# EAGLE design 8CH-Level-Shifter (EAGLE 9.6.2)
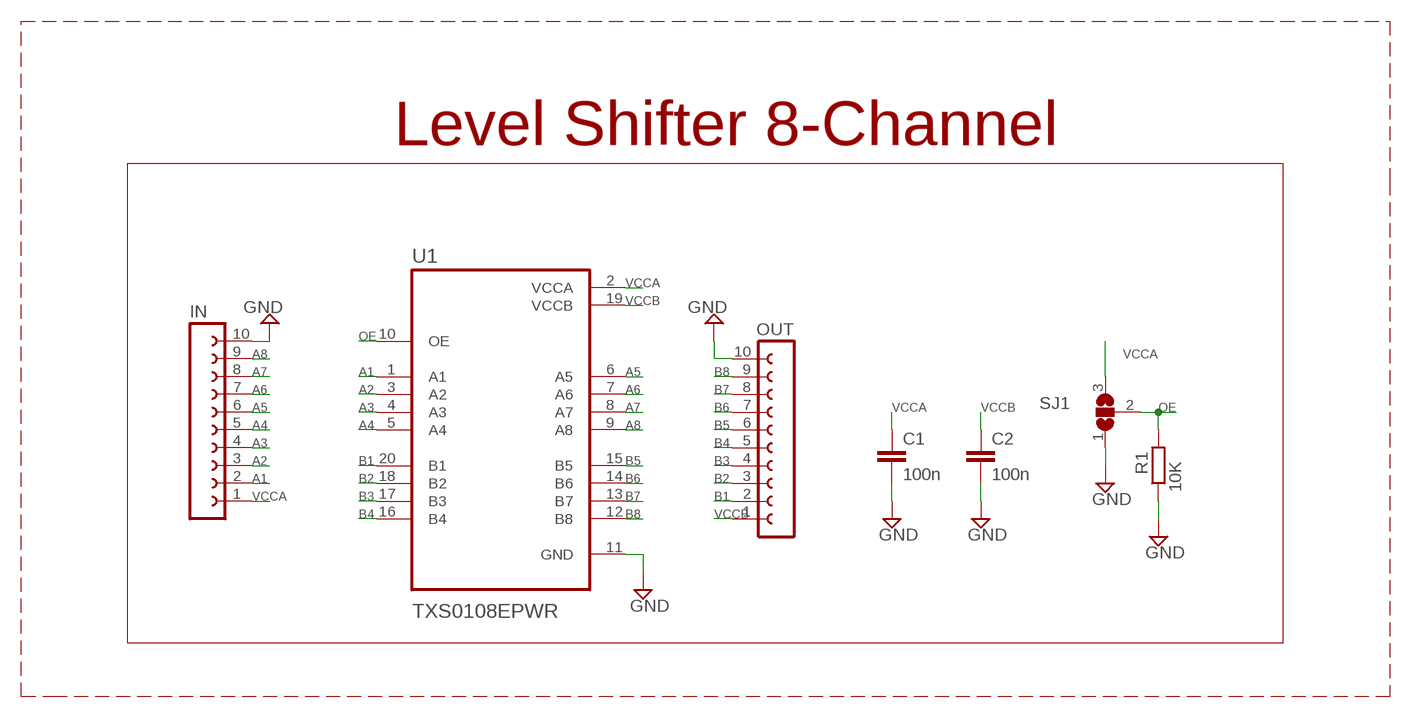
[diagram p0: schematic, sheet 1]

## Parts
C1  100n  C-EUC0805  [C0805]
C2  100n  C-EUC0805  [C0805]
IN  CON-LSTA_FE10-1  [CON-LSTA_FE10]
OUT  CON-LSTA_FE10-1  [CON-LSTA_FE10]
R1  10K  R-EU_R0805  [R0805]
SJ1  SJ2W  [SJ_2]
U1  TXS0108EPWR  [SOP65P640X120-20N]

## Nets
A1: IN.2 U1.1(A1)
A2: IN.3 U1.3(A2)
A3: IN.4 U1.4(A3)
A4: IN.5 U1.5(A4)
A5: IN.6 U1.6(A5)
A6: IN.7 U1.7(A6)
A7: IN.8 U1.8(A7)
A8: IN.9 U1.9(A8)
B1: OUT.2 U1.20(B1)
B2: OUT.3 U1.18(B2)
B3: OUT.4 U1.17(B3)
B4: OUT.5 U1.16(B4)
B5: OUT.6 U1.15(B5)
B6: OUT.7 U1.14(B6)
B7: OUT.8 U1.13(B7)
B8: OUT.9 U1.12(B8)
GND: C1.2 C2.2 IN.10 OUT.10 R1.1 SJ1.1 U1.11(GND)
OE: R1.2 SJ1.2 U1.10(OE)
VCCA: C1.1 IN.1 SJ1.3 U1.2(VCCA)
VCCB: C2.1 OUT.1 U1.19(VCCB)

## Notes on the sheet
- Level Shifter 8-Channel

## Library data of the parts
C1 C2 = rcl:C-EU: CAPACITOR, European symbol; SPICEPREFIX: C
IN OUT = 8CH-Level-Shifter:CON-LSTA_FE10-1: FEMALE HEADER; OC_FARNELL: unknown; OC_NEWARK: unknown
R1 = rcl:R-EU_: RESISTOR, European symbol; SPICEPREFIX: R
SJ1 = jumper:SJ2W: SMD solder JUMPER
U1 = TXS0108EPWR:TXS0108EPWR: Check prices <https://pricing.snapeda.com/parts/TXS0108EPWR/Texas%20Instruments/view-part?ref=eda>; AVAILABILITY: Good; DESCRIPTION: 8-bit bidirectional voltage-level shifter for open-drain and push-pull application 20-TSSOP -40 to 85; MF: Texas Instruments; MP: TXS0108EPWR; PACKAGE: TSSOP-20 Texas Instruments; PRICE: None; PURCHASE-URL: https://pricing.snapeda.com/search/part/TXS0108EPWR/?ref=eda

## Board
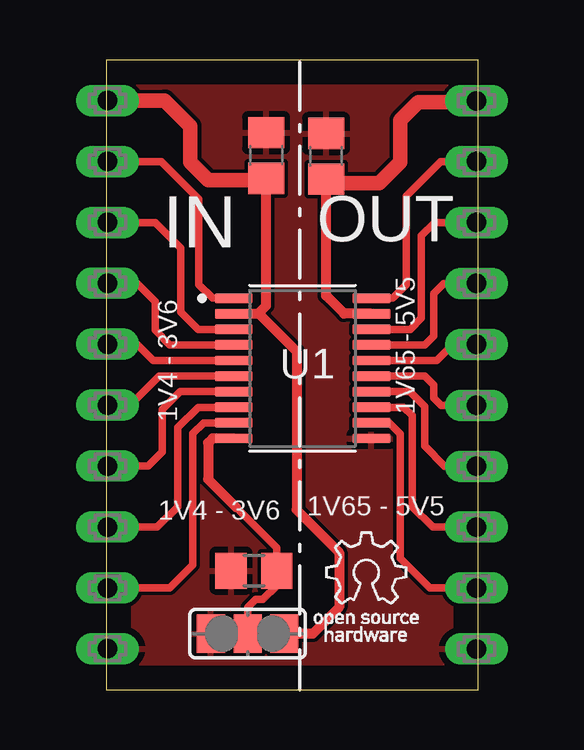
[diagram p1: board, top side]
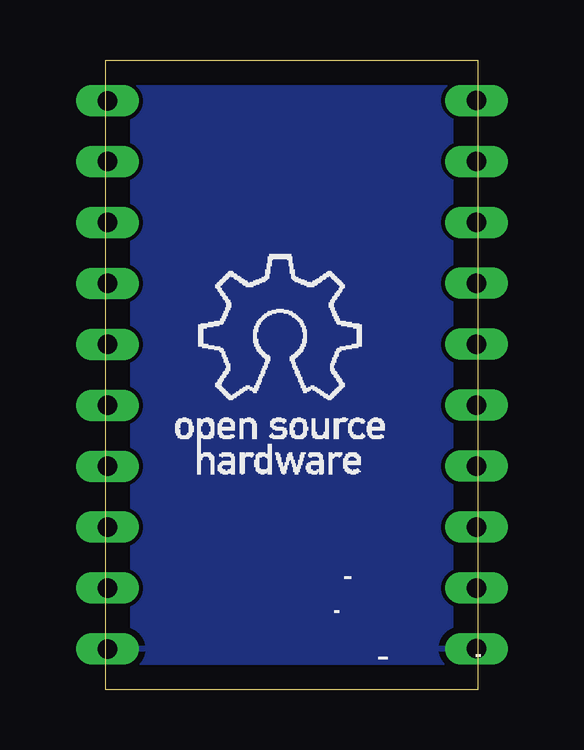
[diagram p2: board, bottom side, seen from below]

Size 15.5 x 26.25 mm. Coordinates in mm from the lower left corner, seen from the top.
Outline: 0,0 15.5,0 15.5,26.25 0,26.25 0,0
Copper layers (1*16): Top 0.035mm / dielectric 1.5mm / Bottom 0.035mm
Design rules "default": minimum track width 6mil, minimum drill 0.35mm, track to track 6mil, track to pad 6mil, pad to pad 6mil, via to via 6mil, smd to smd 6mil, copper to edge 40mil, drill to drill 6mil, minimum pad ring 10mil, minimum via ring 8mil, stop-mask expansion 4mil, vias tented up to drill 0mil, thermal gap 10mil

### Footprints (pad centres in the part's own frame; a part is rotated, then mirrored left to right if it is on the bottom)
C0805 = smd 1.3 x 1.5: 1 -0.95,0; 2 0.95,0
CON-LSTA_FE10 = drill 0.813 long: 1 -11.43,0; 2 -8.89,0; 3 -6.35,0; 4 -3.81,0; 5 -1.27,0; 6 1.27,0; 7 3.81,0; 8 6.35,0; 9 8.89,0; 10 11.43,0
R0805 = smd 1.3 x 1.5: 1 -0.95,0; 2 0.95,0
SJ_2 = smd 1.168 x 1.6: 1 -1.524,0; 2 0,0; 3 1.524,0
SOP65P640X120-20N = smd 1.57 x 0.41: 1 -2.87,2.925; 2 -2.87,2.275; 3 -2.87,1.625; 4 -2.87,0.975; 5 -2.87,0.325; 6 -2.87,-0.325; 7 -2.87,-0.975; 8 -2.87,-1.625; 9 -2.87,-2.275; 10 -2.87,-2.925; 11 2.87,-2.925; 12 2.87,-2.275; 13 2.87,-1.625; 14 2.87,-0.975; 15 2.87,-0.325; 16 2.87,0.325; 17 2.87,0.975; 18 2.87,1.625; 19 2.87,2.275; 20 2.87,2.925

### Placement (x,y rotation side)
C1  6.66,22.27 90 top
C2  9.16,22.23 90 top
IN  0.05,13.13 270 top
OUT  15.42,13.12 270 top
R1  6.15,4.95 0 top
SJ1  5.89,2.33 0 top
U1  8.18,13.39 0 top

### Tracks (layer width: path | path; a pad name or v marks a point on that pad's centre or on a via)
A1
  Top 0.305: 5.18,16.32 U1.1 4.43,16.32 3.86,16.89 3.86,20.45 2.29,22.02 IN.2
A2
  Top 0.305: IN.3 2.04,19.48 3.1,18.41 3.1,15.75 3.83,15.02 U1.3
A3
  Top 0.305: IN.4 1.28,16.94 2.03,16.18 2.03,14.99 2.65,14.37 U1.4
A4
  Top 0.305: IN.5 1.28,14.4 1.96,13.72 U1.5
A5
  Top 0.305: IN.6 0.99,11.86 2.21,13.08 5.3,13.08 U1.6
A6
  Top 0.305: IN.7 1.75,9.32 2.34,9.91 2.34,11.68 3.08,12.42 U1.7
A7
  Top 0.305: IN.8 2.13,6.78 2.97,7.62 2.97,10.92 3.82,11.77 U1.8
A8
  Top 0.305: U1.9 4.06,11.12 3.61,10.67 3.61,5.21 2.64,4.24 IN.9
B1
  Top 0.305: OUT.2 13.94,22.01 12.5,20.57 12.5,16.89 11.93,16.32 U1.20
B2
  Top 0.305: OUT.3 13.68,19.47 13.13,18.92 13.13,15.49 12.66,15.02 U1.18
B3
  Top 0.305: OUT.4 14.06,16.93 13.64,16.51 13.64,14.73 13.28,14.37 U1.17
B4
  Top 0.305: OUT.5 14.44,14.39 13.77,13.72 U1.16
B5
  Top 0.305: OUT.6 13.96,11.85 13.64,12.17 13.64,12.7 13.27,13.07 U1.15
B6
  Top 0.305: OUT.7 14.11,9.31 13.26,10.16 13.26,11.81 12.65,12.42 U1.14
B7
  Top 0.305: OUT.8 13.6,6.77 12.75,7.62 12.75,11.42 12.4,11.77 U1.13
B8
  Top 0.305: OUT.9 13.48,4.23 12.25,5.46 12.25,10.66 11.79,11.12 U1.12
GND
  pour Bottom: -0.07,26.29 15.55,26.29 15.55,0 -0.07,0
  pour Top: -0.07,26.26 15.57,26.26 15.57,0 -0.07,0
OE
  Top 0.305: 5.4,7.61 7.1,5.91 R1.2 7.1,4.33 6.53,3.76 6.23,3.76 5.89,3.42 SJ1.2
  Top 0.406: U1.10 4.43,10.47 4.24,10.29 4.24,8.76 5.4,7.61
VCCA
  Top 0.305: C1.1 6.75,21.23
  Top 0.406: C1.1 6.67,16.01 6.33,15.67 U1.2 6.35,15.67 7.93,14.1 7.93,7.49 9.71,5.71 9.71,3.43 8.61,2.33 SJ1.3
  Top 0.61: IN.1 2.44,24.56 3.5,23.5 3.5,22 4.25,21.25 6.6,21.25 C1.1
VCCB
  Top 0.305: 9,21.12 C2.1 | 11.05,15.7 U1.19
  Top 0.406: U1.19 9.91,15.67 9.16,16.42 C2.1
  Top 0.61: OUT.1 15.37,24.5 13,24.5 12.25,23.75 12.25,22 11.38,21.12 9,21.12

### Text on the board
tNames: 1V4 - 3V6 | 1V65 - 5V5 | 1V4 - 3V6 | 1V65 - 5V5